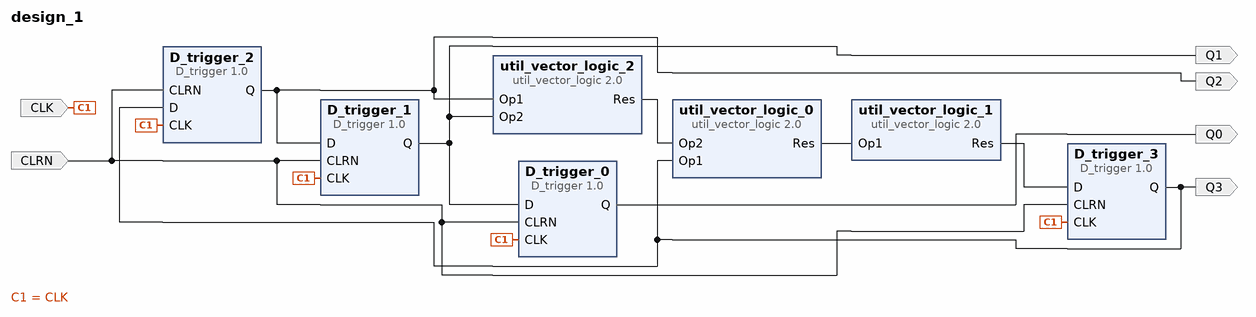
[diagram p0: block diagram of the top level]
# Vivado block design design_1, xc7a35tcsg324-3, Vivado 2017.1
create_bd_design design_1

create_bd_port -dir O Q0
create_bd_port -dir O Q1
create_bd_port -dir O Q2
create_bd_port -dir O Q3
create_bd_port -dir I -type clk CLK
create_bd_port -dir I CLRN

create_bd_cell -type ip -vlnv xilinx.com:user:D_trigger:1.0 D_trigger_0
create_bd_cell -type ip -vlnv xilinx.com:user:D_trigger:1.0 D_trigger_1
create_bd_cell -type ip -vlnv xilinx.com:user:D_trigger:1.0 D_trigger_2
create_bd_cell -type ip -vlnv xilinx.com:user:D_trigger:1.0 D_trigger_3
create_bd_cell -type ip -vlnv xilinx.com:ip:util_vector_logic:2.0 util_vector_logic_0
set_property -dict {CONFIG.C_SIZE 1 CONFIG.C_OPERATION or} [get_bd_cells util_vector_logic_0]
create_bd_cell -type ip -vlnv xilinx.com:ip:util_vector_logic:2.0 util_vector_logic_1
set_property -dict {CONFIG.C_SIZE 1 CONFIG.C_OPERATION not} [get_bd_cells util_vector_logic_1]
create_bd_cell -type ip -vlnv xilinx.com:ip:util_vector_logic:2.0 util_vector_logic_2
set_property -dict {CONFIG.C_SIZE 1 CONFIG.C_OPERATION or} [get_bd_cells util_vector_logic_2]

# ---- connections ----

connect_bd_net [get_bd_pins D_trigger_0/Q] [get_bd_ports Q0]
connect_bd_net [get_bd_pins D_trigger_1/Q] [get_bd_ports Q1] [get_bd_pins D_trigger_0/D] [get_bd_pins util_vector_logic_2/Op2]
connect_bd_net [get_bd_pins D_trigger_2/Q] [get_bd_ports Q2] [get_bd_pins D_trigger_1/D] [get_bd_pins util_vector_logic_2/Op1]
connect_bd_net [get_bd_pins D_trigger_3/Q] [get_bd_ports Q3] [get_bd_pins D_trigger_2/D] [get_bd_pins util_vector_logic_0/Op1]
connect_bd_net [get_bd_pins util_vector_logic_2/Res] [get_bd_pins util_vector_logic_0/Op2]
connect_bd_net [get_bd_pins util_vector_logic_0/Res] [get_bd_pins util_vector_logic_1/Op1]
connect_bd_net [get_bd_pins util_vector_logic_1/Res] [get_bd_pins D_trigger_3/D]
connect_bd_net [get_bd_ports CLK] \
  [get_bd_pins D_trigger_3/CLK] [get_bd_pins D_trigger_2/CLK] [get_bd_pins D_trigger_1/CLK] [get_bd_pins D_trigger_0/CLK]
connect_bd_net [get_bd_ports CLRN] \
  [get_bd_pins D_trigger_3/CLRN] [get_bd_pins D_trigger_2/CLRN] [get_bd_pins D_trigger_1/CLRN] [get_bd_pins D_trigger_0/CLRN]

validate_bd_design
save_bd_design
